# Altium project aakatz ESE6710 Final Project.PrjPcb
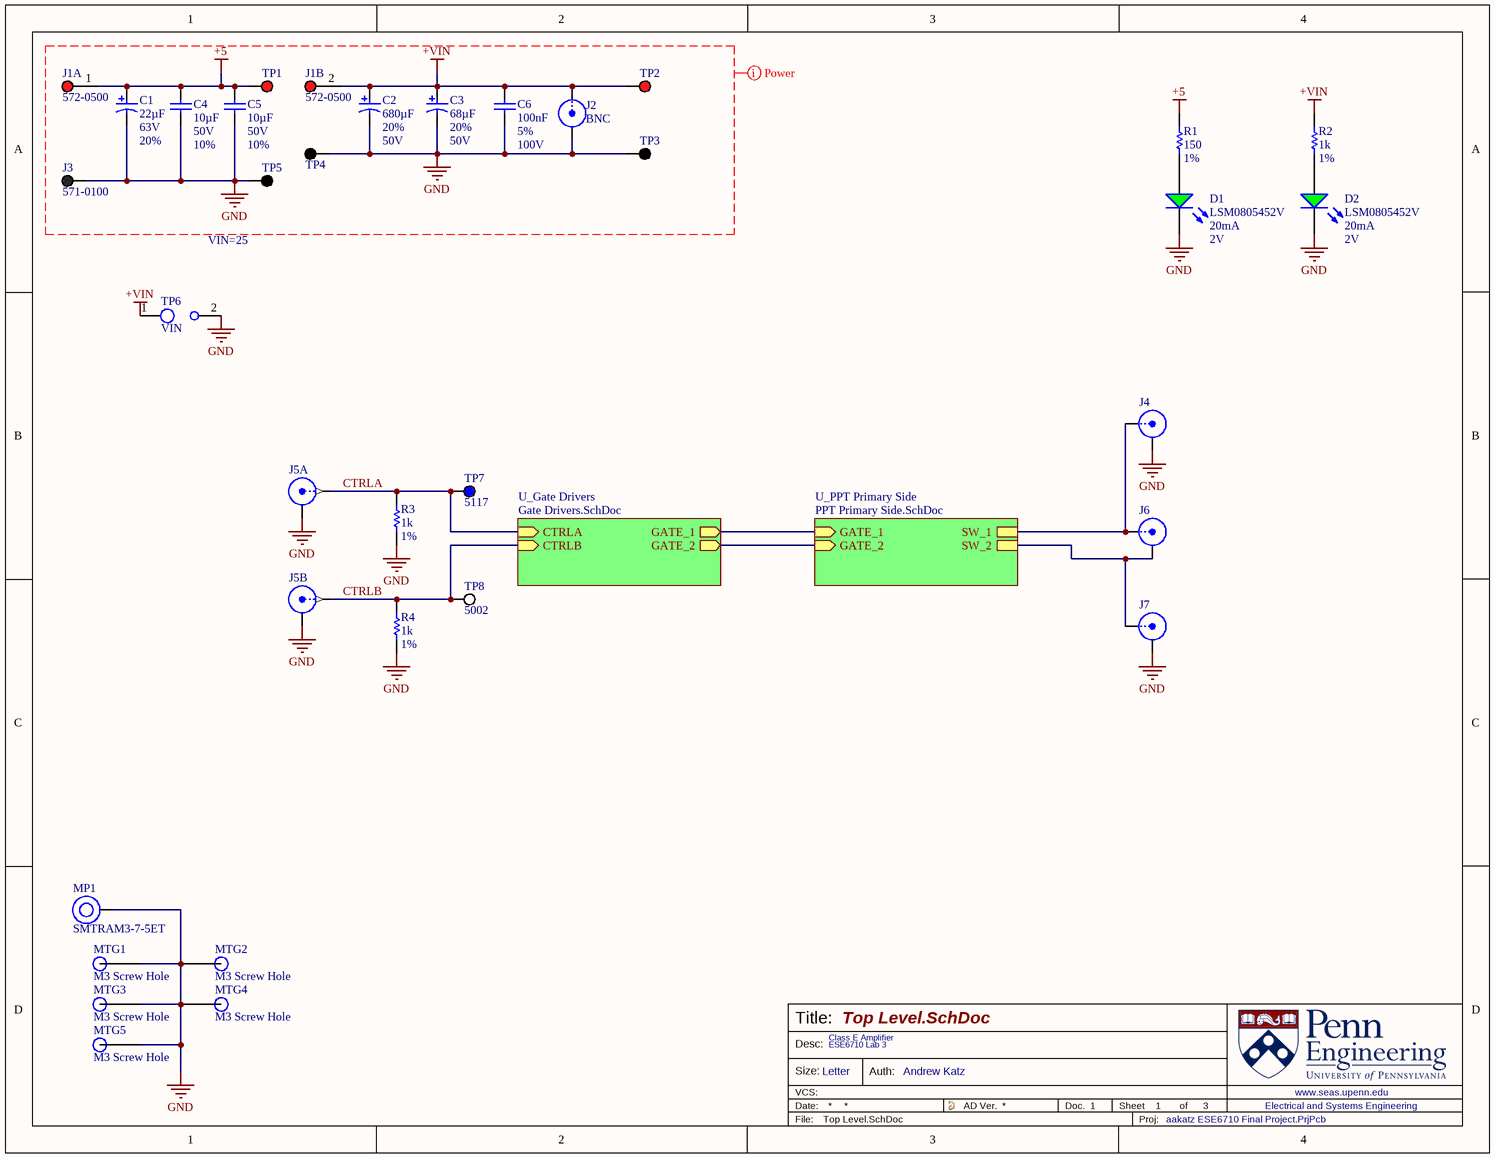
[diagram p0: Top Level.SchDoc]
Author: Andrew Katz
3 sheets, 86 parts. Net scope: hierarchical (ports join the sheet entries above them; power ports are global).
Board file: ESE6710 Final Project.PcbDoc
Sheets:
  Top Level.SchDoc
    U_Gate Drivers = Gate Drivers.SchDoc
    U_PPT Primary Side = PPT Primary Side.SchDoc

## Sheet Top Level.SchDoc
size Letter; DrawnBy: Andrew Katz; Engineer: Andrew Katz; DocumentNumber: 1; SheetNumber: 1; SheetTotal: 3; DescLong1: ESE6710 Lab 3; DescLong2_DescShort: Class E Amplifier

### Parts
C1  value 22µF  Voltage: 63V  Tolerance: 20%  [CAPAE_D8H6_KEMET]  (hidden comment: A768KE226M1JLAE054)
C2  value 680µF  Tolerance: 20%  Voltage: 50V  [FP-RAD-TH-D_12_5_0_5-L_30-MFG]  (hidden comment: EEU-FC1H681L)
C3  value 68µF  Tolerance: 20%  Voltage: 50V  [FP-OS-CON-SMT-F12-MFG]  (hidden comment: 50SVPF68M)
C4  value 10µF  Voltage: 50V  Tolerance: 10%  [1206_CAP]  (hidden comment: CAP 1206 10UF 50V 10% X5R)
C5  value 10µF  Voltage: 50V  Tolerance: 10%  [1206_CAP]  (hidden comment: CAP 1206 10UF 50V 10% X5R)
C6  value 100nF  Tolerance: 5%  Voltage: 100V  [1206_CAP_75H_TDK]  (hidden comment: CAP 1206 0.1UF 100V 5% C0G)
D1  LSM0805452V  Current: 20mA  Forward Voltage: 2V  [LED_0805]
D2  LSM0805452V  Current: 20mA  Forward Voltage: 2V  [LED_0805]
J1  572-0500  [572-0500-Footprint-1]  (parts A,B of 2)
J2  BNC  [112404-Footprint-1]
J3  571-0100  [571-0100-Footprint-1]
J4  CON-SMA-EDGE-S  [FP-SMA-J-P-H-ST-EM1-MFG]  (value not drawn)
J5  031-6575  [031-6575-Footprint-1]  (value not drawn)  (parts A,B of 2)
J6  CON-SMA-EDGE-S  [FP-SMA-J-P-H-ST-EM1-MFG]  (value not drawn)
J7  CON-SMA-EDGE-S  [FP-SMA-J-P-H-ST-EM1-MFG]  (value not drawn)
MP1  SMTRAM3-7-5ET  [SMTRAM3-7-5ET-Footprint-1]
MTG1  M3 Screw Hole  [M3 Screw Hole-Footprint-1]  (no BOM)
MTG2  M3 Screw Hole  [M3 Screw Hole-Footprint-1]  (no BOM)
MTG3  M3 Screw Hole  [M3 Screw Hole-Footprint-1]  (no BOM)
MTG4  M3 Screw Hole  [M3 Screw Hole-Footprint-1]  (no BOM)
MTG5  M3 Screw Hole  [M3 Screw Hole-Footprint-1]  (no BOM)
R1  value 150  Tolerance: 1%  [0805_RES]  (hidden comment: RES 0805 150 1%)
R2  value 1k  Tolerance: 1%  [0805_RES]  (hidden comment: RES 0805 1K 1%)
R3  value 1k  Tolerance: 1%  [0805_RES]  (hidden comment: RES 0805 1K 1%)
R4  value 1k  Tolerance: 1%  [0805_RES]  (hidden comment: RES 0805 1K 1%)
TP1  5280  [KSTN-5010_V]  (value not drawn)
TP2  5280  [KSTN-5010_V]  (value not drawn)
TP3  5281  [KSTN-5011_V]  (value not drawn)
TP4  5281  [KSTN-5011_V]  (value not drawn)
TP5  5281  [KSTN-5011_V]  (value not drawn)
TP6  NetName: VIN  [No Silk Test Point - Scope with Ground Spring-Footprint-1]  (hidden comment: Test Point - Scope with Ground Spring (No Socket))  (no BOM)
TP7  5117  [KSTN-5117]
TP8  5002  [KSTN-5002]

### Sub-sheets
U_Gate Drivers = Gate Drivers.SchDoc: CTRLB (in), CTRLA (in), GATE_2 (out), GATE_1 (out)
U_PPT Primary Side = PPT Primary Side.SchDoc: GATE_1 (in), GATE_2 (in), SW_1, SW_2

### Nets
+5: C1.1 C4.1 C5.1 J1.1 R1.2 TP1.1
+VIN: C2.1 C3.1 C6.2 J1.2 J2.1 R2.2 TP2.1 TP6.1(Signal)
GND: C1.2 C2.2 C3.2 C4.2 C5.2 C6.1 D1.K D2.K J2.2(SHELL) J3.1 J4.2(SHELL) J5.2(SHELL) J5.4(SHELL) J7.2(SHELL) MP1.1 MTG1.1 MTG2.1 MTG3.1 MTG4.1 MTG5.1 R3.1 R4.1 TP3.1 TP4.1 TP5.1 TP6.2(GND)
CTRLA: J5.1 R3.2 TP7.1 ; sheet U_Gate Drivers/CTRLA
CTRLB: J5.3 R4.2 TP8.1 ; sheet U_Gate Drivers/CTRLB
GATE_1: sheet U_Gate Drivers/GATE_1, sheet U_PPT Primary Side/GATE_1
GATE_2: sheet U_Gate Drivers/GATE_2, sheet U_PPT Primary Side/GATE_2
SW_1: J4.1 J6.1 ; sheet U_PPT Primary Side/SW_1
SW_2: J6.2(SHELL) J7.1 ; sheet U_PPT Primary Side/SW_2
NetD1_A: D1.A R1.1
NetD2_A: D2.A R2.1

### Layout directives
net class Power: +5, +VIN, GND

### Notes on the sheet
- VIN=25
- Title:
- Desc:
- Size:
- Letter
- Auth:
- Sheet
- of
- www.seas.upenn.edu
- Electrical and Systems Engineering
- Proj:

### Library data of the parts
C1 = CMP-0001-00000-1: Aluminum Electrolytic Polymer Capacitor, Polarized, 63V, 20% +Tol, 20% -Tol, 22uF, Surface Mount, 3333; Capacitor Type: Aluminum Polymer; Courses: ESE5800; RoHS: Yes; Mount: SMD; RoHS Compliant: Yes; Case/Package: CAPAE; Pins: 2
C2 = CMP-0001-00015-2: Aluminum Electrolytic Capacitor, Polarized, Aluminum (wet), 50V, 20% +Tol, 20% -Tol, 680uF, Through Hole Mount; Dielectric Material: Aluminium; Ripple Current: 1.66125A; Tan Delta: 0.1; Leakage Current: 340uA; Reference Standard: AEC-Q200; Reach SVHC Compliant: Yes; Pins: 2; Package Style: RadialMeter; Termination: Wire; Tolerance (fill in as +-): 20%; Capacitor Type: Aluminium; Tolerance  (fill in as +-): 20%; Case/Package: CAPAE 5L12.5D30H; Mount: SMD; Length: 30mm; Rated DC Voltage (URdc): 50V; Mounting Technology: Through Hole; RoHS: Yes; Terminal Pitch: 5mm; JESD-609 Code: e3; Diameter: 12.5mm; Max Operating Temperature: 105°C; Terminal Finish: Tin; Polarity: Polarized; Min Operating Temperature: -55°C; RoHS Compliant: Yes
C3 = CMP-001-00041-1: Cap Aluminum Polymer 68uF 50VDC 20%( 10 X 12.6mm) SMD 0.02 Ohm 4300mA 5000h 105C T/R; Part Series: SVPF; Manufacturer Lifecycle Status: ACTIVE; Polarity: Polar; Leakage Current: 680µA; Ripple Current: 215mA; Dissipation Factor: 12%; Ripple Current (AC): 4.3A; Life (Hours): 5000hours; Capacitor Type: Aluminium; ESR (Equivalent Series Resistance): 20mΩ; Min Operating Temperature: -55°C; Voltage Rating: 50V; Case/Package: Radial; Diameter: 10mm; Length: 10.3mm; Voltage Rating (DC): 50V; Pins: 12; Lead Free: Lead Free; Number of Terminals: 2; Height: 12.6mm; Material: Polymer; Mounting Technology: Surface Mount; REACH SVHC: Yes; Mount: SMD; Width: 10.3mm; Termination: SMD/SMT; Schedule B: 8532220020, 8532220020; Lifecycle Status: Production; Max Operating Temperature: 105°C; RoHS: Compliant; Height - Seated (Max): 12.7mm
C4 C5 = CMP-001-00003-6: Capacitor Surface Mount 1206 Footprint 10UF 25V 10% Tolerance Ceramic X5R; Manufacturer: Various; PCB Package: 1206; Description in Visual: Cap SMT 1206 10UF 50V 10%  Cer X5R; Case/Package: 1206; RoHS: Yes; JLCPCB Part #: C13585; Manufacturer P/N: CAP 1206 10UF 50V 10% X5R; P/N: CAP 1206 10UF 50V 10% X5R; Type: Ceramic X5R; Capacitor Type: Ceramic; Mount: SMT
C6 = CMP-001-00037-1: 100V 100nF C0G 卤5% 1206 Multilayer Ceramic Capacitors MLCC - SMD/SMT ROHS; Manufacturer Lifecycle Status: PRODUCTION; Temperature Coefficient: 30ppm/°C; Type: Ceramic C0G; PCB Package: 1206; Case Code (Imperial): 1206; Material: Ceramic; Thickness: 1.8034mm; Dielectric: C0G; Min Width: 1.4mm; China RoHS: Compliant; Width: 1.6mm; Schedule B: 8532240020, 8532240020; Voltage Rating (DC): 100V; REACH SVHC: Yes; Max Length: 3.4mm; Lifecycle Status: Production; Case/Package: 1206; Case Code (Metric): 3216; Weight: 16.187578mg; Mounting Technology: Surface Mount; Min Operating Temperature: -55°C; RoHS: Compliant; Length: 3.2mm; Capacitor Type: Ceramic; Termination: SMD/SMT; Number of Terminals: 2; Height: 1.6mm; Mount: SMT; Max Operating Temperature: 125°C; Packaging: Tape & Reel (TR); Voltage Rating: 100V; Min Length: 3mm; Dielectric Material: Ceramic; Max Width: 1.8mm
D1 D2 = CMP-00038-4: Single Color LED, Green, 0805; Wavelength - Peak: 571nm; Package (Case): 0805; RoHS Compliant: Yes; Wavelength - Dominant: 571nm; Color: Green; Test Current: 20mA
J1 = CMP-00800-2: Banana Jack, Red, Dual, 50V (Working), 10A, 1.94MM Rohs Compliant: Yes; Voltage Rating: 250V; Number of Contacts: 2; Body Material: Acetal; Gender: Female; Contact Material: Brass; Color: Red; Termination: Solder; Current Rating: 10A; Radiation Hardening: No; Insulation Material: Acetal; Orientation: Right Angle; REACH SVHC: No; Length: 29.7mm; RoHS: Compliant; Contact Plating: Silver; Operating Supply Voltage: 50V; Mounting Technology: Through Hole; Case/Package: 0500
J2 = CMP-00805-2: BNC Connector Jack, Female Socket 50 Ohms Through Hole Solder; Body Plating: Nickel; Body Material: Brass; Frequency: 3GHz; Connector Type: BNC, Coaxial, Receptacle, Socket; Voltage Rating: 500V; Clock Frequency: 4GHz; Impedance: 50Ω; Gender: Male; Value: 50Ω; Insulation Resistance: 5GΩ; Orientation: Straight; Contact Gender: Female; Fastening Type: Bayonet; Contact Plating: Gold; Housing Color: Silver; Max Operating Temperature: 165°C; Mounting Technology: PCB, Through Hole; Contact Material: Bronze; Insulation Material: Polytetrafluoroethylene; REACH SVHC: Unknown; Termination: Solder; Weight: 4.025009g; Lead Free: Lead Free; Min Operating Temperature: -65°C; Lifecycle Status: Production; RoHS: Compliant; Radiation Hardening: No
J3 = CMP-002-00000-3: Banana Jack, Black; pin to pad: 1>1A+1B
J4 J6 J7 = CMP-00788-5: Sma Female Connector Jack, Pcb Edge Mount Rohs Compliant: Yes; Number of Ports: 1; Impedance: 50Ω; Frequency: 18GHz; Pins: 1; Shell Material: Brass; Case/Package: SMA; Height: 6.35mm; RoHS: Compliant; Contact Gender: Female; Number of Contacts: 1; Contact Material: Gold; Manufacturer Package Identifier: CON-SMA-EDGE-S
J5 = CMP-00819-1: RF / Coaxial Connector, BNC Coaxial, Right Angle Jack, Through Hole Right Angle, 50 ohm; Frequency: 1GHz; Impedance: 50Ω; Body Material: Zinc; Gender: Male; Number of Ports: 2; Body Plating: Nickel; Connector Type: BNC, Coaxial, Connector; Dielectric Material: Polypropylene; Polarity: Standard; Rule: UNIONINDEX=0|RULEKIND=PolygonConnect|NETSCOPE=AnyNet|LAYERKIND=SameLayer|NAME=Schematic Polygon Connect Style|CONNECTSTYLE=Relief|RELIEFCONDUCTORWIDTH=10mil|RELIEFENTRIES=4|POLYGONRELIEFANGLE=90 Angle|AIRGAPWIDTH=10mil|UNIT=Imperial; Contact Material: Bronze; Termination: Solder; Mounting Technology: Bulkhead, Panel, Through Hole; Radiation Hardening: No; Lifecycle Status: Production; Clock Frequency: 1GHz; Orientation: Right Angle; REACH SVHC: Unknown; Max Operating Temperature: 85°C; RoHS: Compliant; Lead Free: Lead Free; Contact Gender: Female; Contact Plating: Gold; Min Operating Temperature: -55°C
MP1 = CMP-00808-2: Surface Mount Rangle M3 Electro-plated Tin; RoHS: Compliant; REACH SVHC: Yes; Lifecycle Status: Production
MTG1-MTG5 = CMP-00028-5: Close clearance Fit for M3 Screw Hole; PCB Mounting for M3 Screw
R1 = CMP-005-004245-3: Resistor Surface Mount, 150 Ohms, 0805 Footprint, 1% Tolerance 0.125W; Manufacturer: Various; Manufacturer P/N: RES 0805 150R 1%; Description in Visual: Res SMT 150 0805  1%  0.125W; PCB Package: 0805; Power Rating: 0.125W; Mount: SMT
R2-R4 = CMP-005-004398-3: Resistor Surface Mount, 1K Ohms, 0805 Footprint, 1% Tolerance 0.125W; Manufacturer: Various; Description in Visual: Res SMT 1K 0805  1%  0.125W; PCB Package: 0805; Mount: SMT; Manufacturer P/N: RES 0805 1K 1%; JLCPCB Part #: C17513; Power Rating: 0.125W
TP1 TP2 = CMP-00794-2: Red PC Test Point, Multipurpose Phosphor Bronze Silver Plating Through Hole Mounting Type, 5010, 5280, Testpoint; Hole Diameter: 1.6mm; Inside Diameter: 1.78mm; Number of Ports: 1; Body Material: PBT; Length: 11.3mm; Orientation: Straight; REACH SVHC: Yes; Material: Bronze, Nylon, Silver; Height: 8.12mm; Mounting Technology: Through Hole; Packaging: Bulk; Lead Free: Lead Free; Contact Plating: Silver; Contact Material: Bronze; Termination: Through Hole; Housing Color: Red; Color: Red; Lifecycle Status: Production; Flammability Rating: UL94 V-0; RoHS: Compliant
TP3-TP5 = CMP-024-000010-4: Test Point, Black, Multipurpose PCB TEST POINT BLACK MULTIPURPOSE 5011 5281; Testpoint
TP6 = CMP-00799-3: Testpoint for scope probe with a ground spring; Probe tip 0.032in-0.046in; 0.350in Ground Spring Clearance (placed at 0.3in)
TP7 = CMP-024-000007-1: Test Point, Blue, 1-Pin THD, RoHS, Bulk; Brand: KeystoneElectronics; Plating: Silver; Mounting Hole Size: 1mm; Outside Diameter: 2.54mm; Pin Count: 1; Datasheet Version: Rev. G, 12/2008; Product: TestPoints; Datasheet URL: https://ciiva.com/datasheet-click-2917627?src=ciiva&sig=bd195616; Color: Blue; Length: 7.62mm; Type: Miniature; Product Category: CircuitBoardHardware-PCB; Component Type: Standard; Packaging: Bulk; Material: Nylon; RoHS: True; Contact Material: PhosphorBronze; Manufacturer URL: http://www.keyelco.com/; Source: Keystone 500x Series.SchLib; Manufacturer: KeystoneElectronics; Design Item ID: 5117
TP8 = CMP-024-000002-1: Test Point, White, 1-Pin THD, RoHS, Bulk; Manufacturer: KeystoneElectronics; Mounting Hole Size: 1mm; Plating: Silver; Outside Diameter: 2.54mm; Product Category: CircuitBoardHardware-PCB; RoHS: True; Manufacturer URL: http://www.keyelco.com/; Packaging: Bulk; Source: Keystone 500x Series.SchLib; Component Type: Standard; Pin Count: 1; Material: Nylon; Datasheet Version: Rev. G, 12/2008; Design Item ID: 5002; Color: White; Product: TestPoints; Type: Miniature; Contact Material: PhosphorBronze; Datasheet URL: https://ciiva.com/datasheet-click-2917627?src=ciiva&sig=bd195616; Length: 7.62mm; Brand: KeystoneElectronics

## Sheet Gate Drivers.SchDoc
size Letter; DrawnBy: Andrew Katz; Engineer: Andrew Katz; DocumentNumber: 2; SheetNumber: 2; SheetTotal: 3
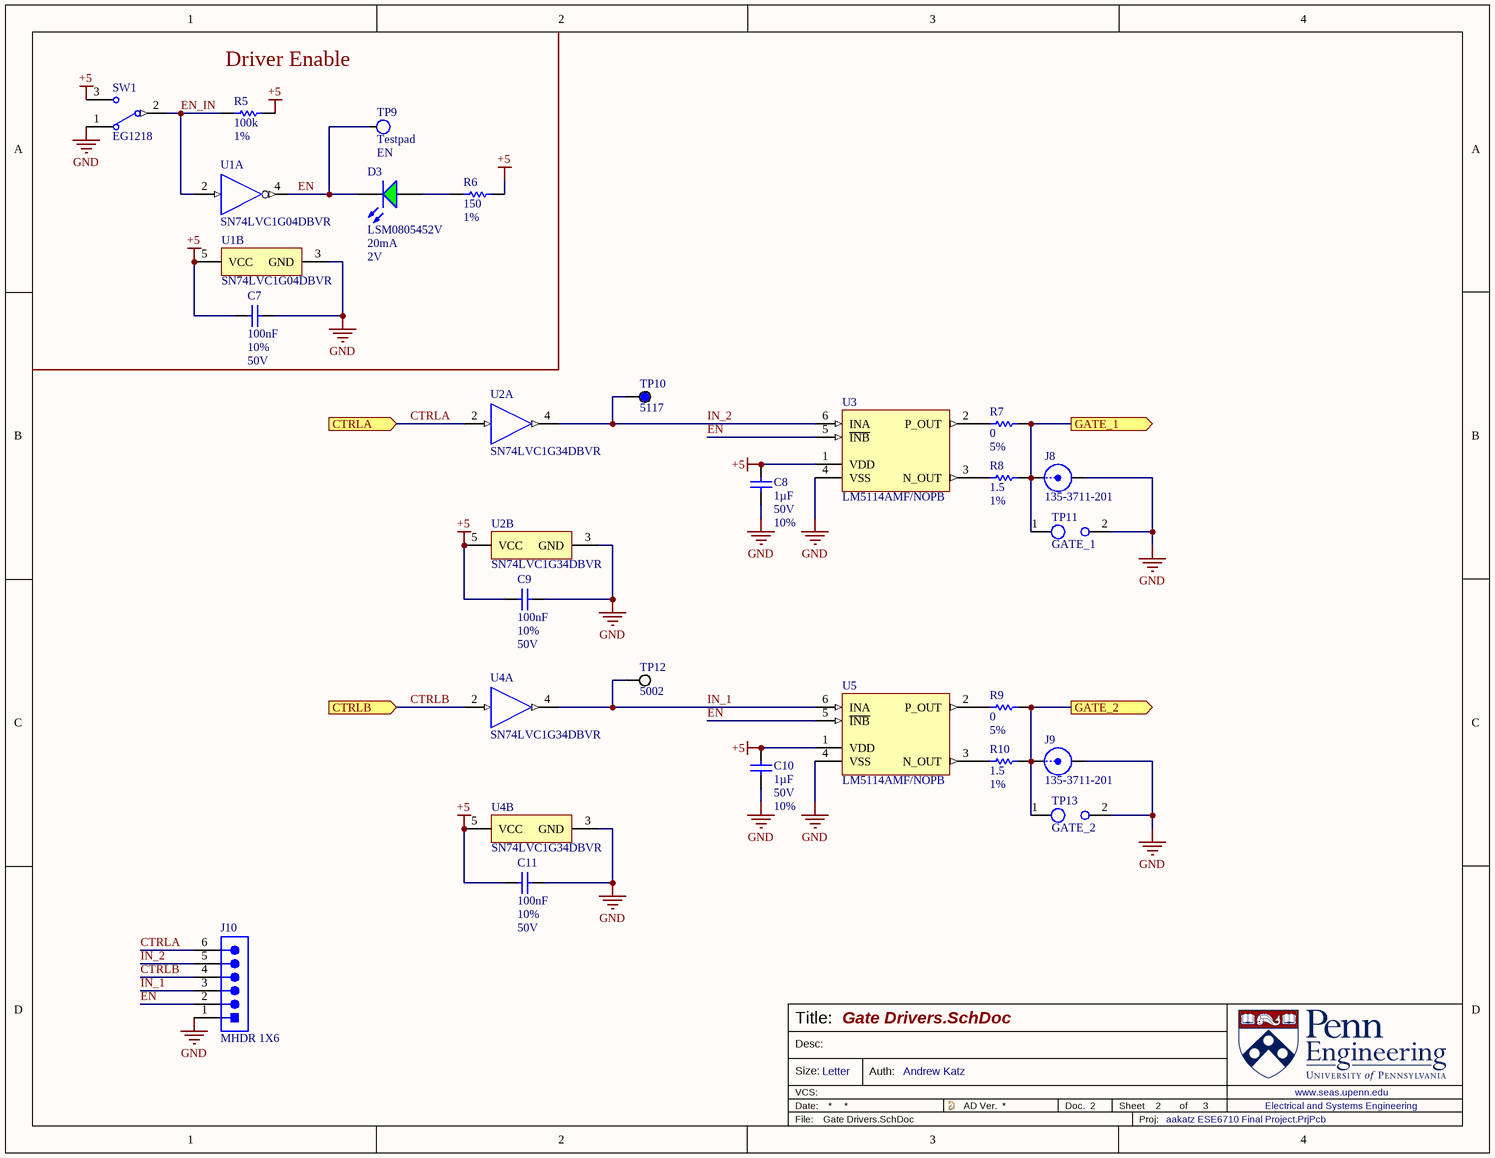
[diagram p1: Gate Drivers.SchDoc]

### Parts
C7  value 100nF  Tolerance: 10%  Voltage: 50V  [0805_CAP]  (hidden comment: CAP 0805 0.1UF 50V 10% X7R)
C8  value 1µF  Voltage: 50V  Tolerance: 10%  [1206_CAP]  (hidden comment: CAP 1206 1.0UF 50V 10% X7R)
C9  value 100nF  Tolerance: 10%  Voltage: 50V  [0805_CAP]  (hidden comment: CAP 0805 0.1UF 50V 10% X7R)
C10  value 1µF  Voltage: 50V  Tolerance: 10%  [1206_CAP]  (hidden comment: CAP 1206 1.0UF 50V 10% X7R)
C11  value 100nF  Tolerance: 10%  Voltage: 50V  [0805_CAP]  (hidden comment: CAP 0805 0.1UF 50V 10% X7R)
D3  LSM0805452V  Current: 20mA  Forward Voltage: 2V  [LED_0805]
J8  135-3711-201  [135-3711-201-Vias-Footprint-1]
J9  135-3711-201  [135-3711-201-Vias-Footprint-1]
J10  MHDR 1X6  [MHDR 1X6]
R5  value 100k  Tolerance: 1%  [0805_RES]  (hidden comment: RES 0805 100K 1%)
R6  value 150  Tolerance: 1%  [0805_RES]  (hidden comment: RES 0805 150 1%)
R7  value 0  Tolerance: 5%  [0603_RES]  (hidden comment: RES 0603 0 5%)
R8  value 1.5  Tolerance: 1%  [0603_RES]  (hidden comment: RES 0603 1.5 1%)
R9  value 0  Tolerance: 5%  [0603_RES]  (hidden comment: RES 0603 0 5%)
R10  value 1.5  Tolerance: 1%  [0603_RES]  (hidden comment: RES 0603 1.5 1%)
SW1  EG1218  [ESWI-EG1218_V]
TP9  Testpad  NetName: EN  [Test PTH 15-30]  (no BOM)
TP10  5117  [KSTN-5117]
TP11  NetName: GATE_1  [No Silk Test Point - Scope with Ground Spring-Footprint-1]  (hidden comment: Test Point - Scope with Ground Spring (No Socket))  (no BOM)
TP12  5002  [KSTN-5002]
TP13  NetName: GATE_2  [No Silk Test Point - Scope with Ground Spring-Footprint-1]  (hidden comment: Test Point - Scope with Ground Spring (No Socket))  (no BOM)
U1  SN74LVC1G04DBVR  [DBV0005A_N]  (parts A,B of 2)
U2  SN74LVC1G34DBVR  [DBV0005A_N]  (parts A,B of 2)
U3  LM5114AMF/NOPB  [DBV0006A_N]
U4  SN74LVC1G34DBVR  [DBV0005A_N]  (parts A,B of 2)
U5  LM5114AMF/NOPB  [DBV0006A_N]

### Ports
CTRLA (in), CTRLB (in), GATE_1 (out), GATE_2 (out)

### Nets
+5: C7.1 C8.2 C9.1 C10.2 C11.1 R5.2 R6.2 SW1.3 U1.5(VCC) U2.5(VCC) U3.1(VDD) U4.5(VCC) U5.1(VDD)
GND: C7.2 C8.1 C9.2 C10.1 C11.2 J8.2(SHELL) J9.2(SHELL) J10.1 SW1.1 TP11.2(GND) TP13.2(GND) U1.3(GND) U2.3(GND) U3.4(VSS) U4.3(GND) U5.4(VSS)
CTRLA: J10.6 U2.2(A) ; port CTRLA
CTRLB: J10.4 U4.2(A) ; port CTRLB
EN: D3.K J10.2 TP9.1 U1.4(Y) U3.5(~{INB}) U5.5(~{INB})
EN_IN: R5.1 SW1.2(COM) U1.2(A)
GATE_1: J8.1 R7.2 R8.2 TP11.1(Signal) ; port GATE_1
GATE_2: J9.1 R9.2 R10.2 TP13.1(Signal) ; port GATE_2
IN_1: J10.3 TP12.1 U4.4(Y) U5.6(INA)
IN_2: J10.5 TP10.1 U2.4(Y) U3.6(INA)
NetD3_A: D3.A R6.1
NetR7_1: R7.1 U3.2(P_OUT)
NetR8_1: R8.1 U3.3(N_OUT)
NetR9_1: R9.1 U5.2(P_OUT)
NetR10_1: R10.1 U5.3(N_OUT)

Not connected (* = marked no-connect by the designer): U1 1(NC); U2 1(NC); U4 1(NC)

### Notes on the sheet
- Driver Enable
- Title:
- Desc:
- Size:
- Letter
- Auth:
- Sheet
- of
- www.seas.upenn.edu
- Electrical and Systems Engineering
- Proj:

### Library data of the parts
C7 C9 C11 = CMP-011-000431-5: Capacitor Surface Mount 0805 Footprint 0.1UF 50V 10% Tolerance Ceramic X7R; Manufacturer: Various; Description in Visual: Cap SMT 0805 0.1UF 50V 10%  Cer X7R; PCB Package: 0805; Capacitor Type: Ceramic; Type: Ceramic X7R; RoHS: Yes; Case/Package: 0805; Pins: 2; P/N: CAP 0805 0.1UF 50V 10% X7R; Mount: SMT; Manufacturer P/N: CAP 0805 0.1UF 50V 10% X7R
C8 C10 = CMP-011-000623-2: Capacitor Surface Mount 1206 Footprint 1.0UF 50V 10% Tolerance Ceramic X7R; Manufacturer: Various; PCB Package: 1206; Description in Visual: Cap SMT 1206 1.0UF 50V 10%  Cer X7R; Manufacturer P/N: CAP 1206 1.0UF 50V 10% X7R; Case/Package: 1206; Mount: SMT; P/N: CAP 1206 1.0UF 50V 10% X7R; RoHS: Yes; Capacitor Type: Ceramic; Type: Ceramic X7R
D3 = CMP-00038-4: as D1 on sheet Top Level; RoHS Compliant: Yes; Wavelength - Dominant: 571nm; Color: Green; Test Current: 20mA
J8 J9 = CMP-00804-2: RF / Coaxial Connector, MMCX Coaxial, Straight Jack, Surface Mount Straight, 50 ohm; Manufacturer Lifecycle Status: PRODUCTION; Connector Type: Coaxial, MMCX, Socket; Voltage Rating: 170V; Gender: Female; Number of Ports: 1; Insulation Resistance: 1GΩ; Insertion Loss (dB): 0.1dB; Body Plating: Copper, Gold; Dielectric Material: PTFE; Contact Resistance: 8mΩ; Body Material: Brass; Plating: Gold; Impedance: 50Ω; Operating Force: 35.584N; Frequency: 6GHz; Housing Material: Brass; Shell Material: Brass; RoHS: Compliant; Length: 5.0038mm; Orientation: Straight; Packaging: Box; Contact Plating: Gold; Contact Gender: Female; Fastening Type: Snap; Mounting Technology: PCB, Surface Mount; Number of Positions: 1; Termination: Solder; Radiation Hardening: No; Contact Material: Copper; Insulation Material: PTFE; Min Operating Temperature: -55°C; China RoHS: Compliant; Lifecycle Status: Production; Housing Color: Gold; Lead Free: Lead Free; REACH SVHC: No; Clock Frequency: 6GHz; Pins: 1; Max Operating Temperature: 155°C
J10 = CMP-00091-3: Header, 6-Pin, 0.1in Pitch, Male; Reliability: COMMERCIAL; Mounting Option 1: LOCKING; Number of Contacts: 6; Rated Current (Signal): 3A; Contact Pattern: RECTANGULAR; Number Of Connectors: 1; Connector Type: BOARD CONNECTOR; Mating Contact Pitch: 0.1inch; Body/Shell Style: PLUG; Contact Resistance: 20mR; Pitch: 0.1 inch; Contact Style: SQ PIN-SKT; Body Length: 0.6inch; Insulation Resistance: 1GR; Dielectric Withstanding Voltage (AC): 500V; Reference Standard: UL; Max Operating Temperature: 125°C; Contact Finish - Mating: GOLD; Terminal Length: 0.118inch; Mounting Style: STRAIGHT; Body Breadth: 0.1inch; JESD-609 Code: e4; Min Operating Temperature: -40°C; Contact Material: Copper Alloy; Terminal Pitch: 2.54mm; PCB Contact Pattern: RECTANGULAR; Mounting Technology: Board; Contact Gender: Male; JLCPCB Part #: C178289; Insulation Material: Polybutylene; Insulation Color: Black; Reach SVHC Compliant: Yes; Body Depth: 0.1inch; RoHS Compliant: Yes; Number of Rows Loaded: 1; Contact Finish - Termination: Gold (Au) - with Nickel (Ni) barrier; Termination: Solder
R5 = CMP-005-004027-2: Resistor Surface Mount, 100K Ohms, 0805 Footprint, 1% Tolerance 0.125W; Manufacturer: Various; Description in Visual: Res SMT 100K 0805  1%  0.125W; PCB Package: 0805; Power Rating: 0.125W; Mount: SMT; Manufacturer P/N: RES 0805 100K 1%
R6 = CMP-005-004245-3: as R1 on sheet Top Level; Power Rating: 0.125W; Mount: SMT
R7 R9 = CMP-005-001964-4: Resistor Surface Mount, 0 Ohms, 0603 Footprint, 5% Tolerance 0.1W; Manufacturer P/N: RES 0603 0R 5%; Manufacturer: Various; PCB Package: 0603; Description in Visual: Res SMT 0 0603  5%  0.1W; Power Rating: 0.1W; Mount: SMT; JLCPCB Part #: C21189
R8 R10 = CMP-00793-3: Resistor Surface Mount, 1.5 Ohms, 0603 Footprint, 1% Tolerance 0.1W; Manufacturer P/N: RES 0603 1R5 1%; Manufacturer: Various; PCB Package: 0603; Description in Visual: Res SMT 1.5R 0603  1%  0.1W; Power Rating: 0.1W; Mount: SMT
SW1 = CMP-00099-1: Slide Switch, 2 Positions, SPDT, Latched, 0.2A, 30VDC, 3 PCB Hole Cnt, Solder Terminal, Through Hole-straight; Body Length or Diameter: 11.6mm; Body Height: 5.4mm; Body Breadth: 4inch; Reach SVHC Compliant: Yes; RoHS Compliant: Yes; Switch Type: Slide Switch; Terminal Finish: Silver; JESD-609 Code: e4; Switch Action: LATCHED; Mounting Technology: Through Hole; Switch Function: SPDT; Max Operating Temperature: 70°C; Termination: Solder; Min Operating Temperature: -20°C
TP9 = CMP-00049-8: Test Pad/Point (Testpoint, Testpad), for probing
TP10 = CMP-024-000007-1: as TP7 on sheet Top Level; Pin Count: 1; Datasheet Version: Rev. G, 12/2008; Product: TestPoints; Datasheet URL: https://ciiva.com/datasheet-click-2917627?src=ciiva&sig=bd195616; Color: Blue; Length: 7.62mm; Type: Miniature; Product Category: CircuitBoardHardware-PCB; Component Type: Standard; Packaging: Bulk; Material: Nylon; RoHS: True; Contact Material: PhosphorBronze; Manufacturer URL: http://www.keyelco.com/; Source: Keystone 500x Series.SchLib; Manufacturer: KeystoneElectronics; Design Item ID: 5117
TP11 TP13 = CMP-00799-3: as TP6 on sheet Top Level
TP12 = CMP-024-000002-1: as TP8 on sheet Top Level; Product Category: CircuitBoardHardware-PCB; RoHS: True; Manufacturer URL: http://www.keyelco.com/; Packaging: Bulk; Source: Keystone 500x Series.SchLib; Component Type: Standard; Pin Count: 1; Material: Nylon; Datasheet Version: Rev. G, 12/2008; Design Item ID: 5002; Color: White; Product: TestPoints; Type: Miniature; Contact Material: PhosphorBronze; Datasheet URL: https://ciiva.com/datasheet-click-2917627?src=ciiva&sig=bd195616; Length: 7.62mm; Brand: KeystoneElectronics
U1 = CMP-082-000026-1: SINGLE INVERTER GATE Inverter, LVC/LCX/Z Series, 1-Func, 1-Input, CMOS, PDSO5; Manufacturer Lifecycle Status: ACTIVE; Number of Gates: 1; Turn-On Delay Time: 7.5ns; Max Supply Voltage: 5.5V; Min Supply Voltage: 1.65V; Logic Function: Inverting; Nominal Supply Current: 10µA; Propagation Delay: 3.7ns; High Level Output Current: -32mA; Low Level Output Current: 32mA; Frequency: 150MHz; Schmitt Trigger Input: No; Schedule B: 8542390000, 8542390000; Radiation Hardening: No; Length: 2.9mm; Number of Bits: 1; Min Operating Temperature: -40°C; Case/Package: SOT-23; Width: 1.6mm; Ambient Temperature Range High: 125°C; Contact Plating: Tin; RoHS: Compliant; REACH SVHC: No; Packaging: Cut Tape; Thickness: 1.2mm; Lifecycle Status: Production; Mounting Technology: Surface Mount; Number of Outputs: 1; Number of Channels: 1; Number of Elements: 1; Lead Free: Lead Free; Height: 1.45mm; Max Operating Temperature: 125°C; Quiescent Current: 10µA; Number of Inputs: 1; Pins: 5; Number of Circuits: 1; Weight: 15.790684mg; Termination: SMD/SMT; Max Output current: 32mA; Output Current: 32mA
U2 U4 = CMP-00787-1: 1 32mA 1.65V~5.5V 32mA 1 SOT-23-5 Buffer/Driver/Transceiver ROHS; Manufacturer Lifecycle Status: ACTIVE; Number of Gates: 1; Turn-On Delay Time: 9.9ns; Max Supply Voltage: 5.5V; Min Supply Voltage: 1.5V; Logic Function: Buffer, Inverting; Nominal Supply Current: 10µA; Propagation Delay: 3.9ns; High Level Output Current: -32mA; Max Junction Temperature (Tj): 150°C; Quiescent Current: 1µA; Polarity: Non-Inverting; Schedule B: 8542390000, 8542390000; Radiation Hardening: No; Length: 2.9mm; Number of Bits: 1; Min Operating Temperature: -40°C; Case/Package: SOT-23; Width: 1.6mm; Ambient Temperature Range High: 125°C; Contact Plating: Gold; RoHS: Compliant; REACH SVHC: No; Packaging: Cut Tape; Thickness: 1.2mm; Lifecycle Status: Production; Mounting Technology: Surface Mount; Number of Outputs: 1; Number of Bits per Element: 1; Number of Channels: 1; Low Level Output Current: 32mA; Number of Input Lines: 1; Number of Elements: 1; Lead Free: Lead Free; Height: 1.45mm; Number of Output Lines: 1; Max Operating Temperature: 125°C; Number of Inputs: 1; Pins: 5; Number of Circuits: 1
U3 U5 = CMP-00786-2: 7.6-A/1.3-A single channel gate driver with 4-V UVLO and split outputs 6-SOT-23 -40 to 125; Manufacturer Lifecycle Status: ACTIVE; Fall Time: 8ns; Number of Outputs: 2; Turn-Off Delay Time: 36ns; Value: 310mΩ; Max Output current: 7.6A; Rise Time: 3.2ns; Number of Drivers: 1; Nominal Supply Current: 1.3A; Min Supply Voltage: 4V; Max Supply Voltage: 12.6V; Case/Package: SOT-23; Lead Free: Lead Free; Lifecycle Status: Production; Turn-On Delay Time: 36ns; Length: 2.9mm; Height: 0m; Element Configuration: Single; Width: 1.6mm; Pins: 6; Mounting Technology: Surface Mount; Min Operating Temperature: -40°C; Max Operating Temperature: 125°C; RoHS: Compliant; Output Current: 7.6A; Thickness: 1.2mm; Channel Type: Single; Number of Channels: 1

## Sheet PPT Primary Side.SchDoc
size Letter; DrawnBy: Andrew Katz; Engineer: Andrew Katz; DocumentNumber: 3; SheetNumber: 3; SheetTotal: 3
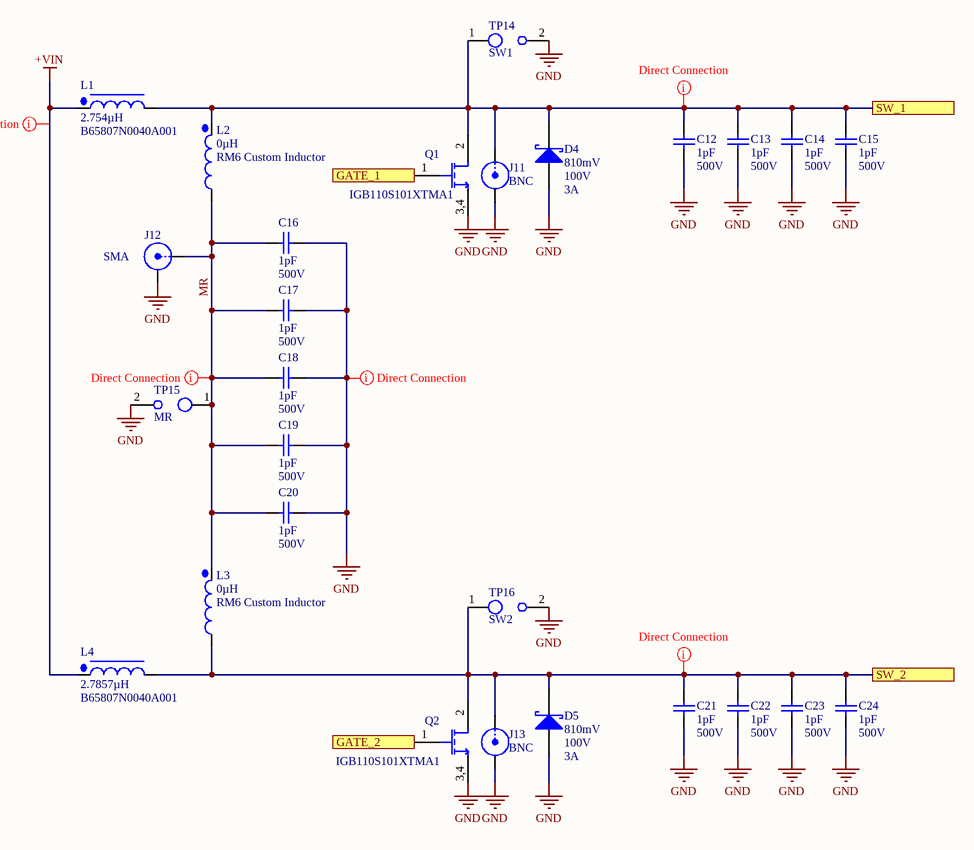
[diagram p2: PPT Primary Side.SchDoc]

### Parts
C12  value 1pF  Voltage: 500V  [CAP_1111_ATC 800B]  (hidden comment: 800B1R0BT500XT1K)
C13  value 1pF  Voltage: 500V  [CAP_1111_ATC 800B]  (hidden comment: 800B1R0BT500XT1K)
C14  value 1pF  Voltage: 500V  [CAP_1111_ATC 800B]  (hidden comment: 800B1R0BT500XT1K)
C15  value 1pF  Voltage: 500V  [CAP_1111_ATC 800B]  (hidden comment: 800B1R0BT500XT1K)
C16  value 1pF  Voltage: 500V  [CAP_1111_ATC 800B]  (hidden comment: 800B1R0BT500XT1K)
C17  value 1pF  Voltage: 500V  [CAP_1111_ATC 800B]  (hidden comment: 800B1R0BT500XT1K)
C18  value 1pF  Voltage: 500V  [CAP_1111_ATC 800B]  (hidden comment: 800B1R0BT500XT1K)
C19  value 1pF  Voltage: 500V  [CAP_1111_ATC 800B]  (hidden comment: 800B1R0BT500XT1K)
C20  value 1pF  Voltage: 500V  [CAP_1111_ATC 800B]  (hidden comment: 800B1R0BT500XT1K)
C21  value 1pF  Voltage: 500V  [CAP_1111_ATC 800B]  (hidden comment: 800B1R0BT500XT1K)
C22  value 1pF  Voltage: 500V  [CAP_1111_ATC 800B]  (hidden comment: 800B1R0BT500XT1K)
C23  value 1pF  Voltage: 500V  [CAP_1111_ATC 800B]  (hidden comment: 800B1R0BT500XT1K)
C24  value 1pF  Voltage: 500V  [CAP_1111_ATC 800B]  (hidden comment: 800B1R0BT500XT1K)
D4  Forward Voltage: 810mV  Reverse Standoff Voltage: 100V  Max Output current: 3A  [ST-SOD128FL]  (hidden comment: RB058LAM100TFTR)
D5  Forward Voltage: 810mV  Reverse Standoff Voltage: 100V  Max Output current: 3A  [ST-SOD128FL]  (hidden comment: RB058LAM100TFTR)
J11  BNC  [112404-Footprint-1]
J12  SMA  [FP-RF2-04A-T-00-50-G-MFG]
J13  BNC  [112404-Footprint-1]
L1  B65807N0040A001  value 2.754µH  [B65808N1006D001-Alt2-Footprint-1]
L2  RM6 Custom Inductor  value 0µH  [B65808N1006D001-Alt2-Footprint-1]
L3  RM6 Custom Inductor  value 0µH  [B65808N1006D001-Alt2-Footprint-1]
L4  B65807N0040A001  value 2.7857µH  [B65808N1006D001-Alt2-Footprint-1]
Q1  IGB110S101XTMA1  [IGB110S101XTMA1-Footprint-1]
Q2  IGB110S101XTMA1  [IGB110S101XTMA1-Footprint-1]
TP14  NetName: SW1  [No Silk Test Point - Scope with Ground Spring-Footprint-1]  (hidden comment: Test Point - Scope with Ground Spring (No Socket))  (no BOM)
TP15  NetName: MR  [No Silk Test Point - Scope with Ground Spring-Footprint-1]  (hidden comment: Test Point - Scope with Ground Spring (No Socket))  (no BOM)
TP16  NetName: SW2  [No Silk Test Point - Scope with Ground Spring-Footprint-1]  (hidden comment: Test Point - Scope with Ground Spring (No Socket))  (no BOM)

### Ports
GATE_1 (in), GATE_2 (in), SW_1, SW_2

### Nets
+VIN: L1.1 L4.1
GND: C12.1 C13.1 C14.1 C15.1 C16.2 C17.2 C18.2 C19.2 C20.2 C21.1 C22.1 C23.1 C24.1 D4.A D5.A J11.2(SHELL) J12.2(SHELL) J13.2(SHELL) Q1.3,4(S) Q2.3,4(S) TP14.2(GND) TP15.2(GND) TP16.2(GND)
GATE_1: Q1.1(G) ; port GATE_1
GATE_2: Q2.1(G) ; port GATE_2
MR: C16.1 C17.1 C18.1 C19.1 C20.1 J12.1 L2.2 L3.1 TP15.1(Signal)
SW_1: C12.2 C13.2 C14.2 C15.2 D4.K J11.1 L1.2 L2.1 Q1.2(D) TP14.1(Signal) ; port SW_1
SW_2: C21.2 C22.2 C23.2 C24.2 D5.K J13.1 L3.2 L4.2 Q2.2(D) TP16.1(Signal) ; port SW_2

### Layout directives
net class Direct Connection: +VIN, GND, MR, SW_1, SW_2

### Notes on the sheet
- Title:
- Desc:
- Size:
- Letter
- Auth:
- Sheet
- of
- www.seas.upenn.edu
- Electrical and Systems Engineering
- Proj:

### Library data of the parts
C12-C24 = CMP-001-00029-1: Ceramic Capacitor, Multilayer, Ceramic, 500V, 50% +Tol, 50% -Tol, C0G, 30ppm/Cel TC, 0.000001uF, Surface Mount, 1111; Lifecycle Status: Production; Dielectric Material: Ceramic; RoHS: Compliant; Mount: SMD; REACH SVHC: Yes; Max Operating Temperature: 125°C; Mounting Technology: Surface Mount; Case/Package: 1111; Capacitor Type: Ceramic; Voltage Rating (DC): 500V; Min Operating Temperature: -55°C; China RoHS: Compliant; Width: 2.79mm; Height: 1.78mm; Length: 2.79mm; Number of Terminals: 2
D4 D5 = CMP-00827-1: Rectifier Diode, Schottky, 1 Phase, 1 Element, 3A, 100V V(RRM), Silicon; Max Forward Surge Current (Ifsm): 80A; Peak Reverse Current: 3µA; Number of Elements: 1; REACH SVHC: No; Lifecycle Status: Production; Number of Terminals: 2; Max Operating Temperature: 150°C; China RoHS: Non-Compliant; RoHS: Compliant; Mounting Technology: Surface Mount
J11 J13 = CMP-00805-2: as J2 on sheet Top Level; Orientation: Straight; Contact Gender: Female; Fastening Type: Bayonet; Contact Plating: Gold; Housing Color: Silver; Max Operating Temperature: 165°C; Mounting Technology: PCB, Through Hole; Contact Material: Bronze; Insulation Material: Polytetrafluoroethylene; REACH SVHC: Unknown; Termination: Solder; Weight: 4.025009g; Lead Free: Lead Free; Min Operating Temperature: -65°C; Lifecycle Status: Production; RoHS: Compliant; Radiation Hardening: No
J12 = CMP-00789-4: Connector SMA Jack 0Hz to 6GHz 50Ohm Solder ST Thru-Hole F Gold; Impedance: 50Ω; Number of Contacts: 1; Voltage Rating: 500V; Dielectric Material: PTFE; RoHS: Compliant; Lifecycle Status: Production; REACH SVHC: Yes; Contact Material: Gold; Min Operating Temperature: -65°C; Frequency: 6GHz; Height: 10.3378mm; Schedule B: 8536695050; Max Operating Temperature: 165°C
L1-L4 = CMP-00815-11: BOBBIN COIL FORMER RM 6; pin to pad: 1>1+2+6 2>3+4+5
Q1 Q2 = CMP-00811-1: 100 V 23 A 9.4 mOhm N-Channel PQFN 3x3 GaN MOSFET; pin to pad: 3,4>3+4; Continuous Drain Current (ID): 23A; Drain to Source Resistance: 11mΩ; Max Power Dissipation: 15W; Number of Elements: 1; Min Breakdown Voltage: 100V; Number of Terminals: 4; Max Operating Temperature: 150°C; Min Operating Temperature: -40°C; Lifecycle Status: Production; REACH SVHC: Yes; RoHS: Compliant
TP14-TP16 = CMP-00799-3: as TP6 on sheet Top Level

## Nets that join several sheets
+5: Top Level (6 pins), Gate Drivers (13 pins)
+VIN: Top Level (8 pins), PPT Primary Side (L1.1 L4.1)
GND: Top Level (26 pins), Gate Drivers (16 pins), PPT Primary Side (23 pins)
CTRLA: Top Level (J5.1 R3.2 TP7.1), Gate Drivers (J10.6 U2.2)
CTRLB: Top Level (J5.3 R4.2 TP8.1), Gate Drivers (J10.4 U4.2)
GATE_1: Gate Drivers (J8.1 R7.2 R8.2 TP11.1), PPT Primary Side (Q1.1)
GATE_2: Gate Drivers (J9.1 R9.2 R10.2 TP13.1), PPT Primary Side (Q2.1)
SW_1: Top Level (J4.1 J6.1), PPT Primary Side (10 pins)
SW_2: Top Level (J6.2 J7.1), PPT Primary Side (10 pins)

## Assembly variants
Alts: alternate parts C13 -> CMP-001-00032-1
bom: not fitted C1 C2 C3
as built: not fitted C12 C14 C15 C16 C19 C20 C21 C24 J4 J7; alternate parts C17 -> CMP-0001-00017-3, C18 -> CMP-001-00042-1, C13 -> CMP-001-00051-1, C22 -> CMP-001-00051-1, C23 -> CMP-001-00052-1, L2 -> CMP-002-000036-1, L3 -> CMP-002-000036-1